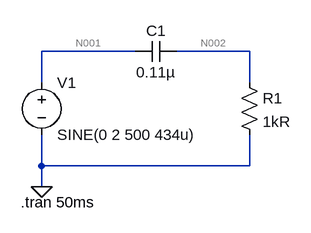
[diagram p0: schematic Draft1.asc]
Draft1.asc, the LTspice schematic file:
Version 4
SHEET 1 880 680
WIRE 176 64 32 64
WIRE 352 64 240 64
WIRE 32 112 32 64
WIRE 352 112 352 64
WIRE 32 240 32 192
WIRE 352 240 352 192
WIRE 352 240 32 240
WIRE 32 272 32 240
FLAG 32 272 0
SYMBOL voltage 32 96 R0
WINDOW 123 0 0 Left 0
WINDOW 39 0 0 Left 0
SYMATTR InstName V1
SYMATTR Value SINE(0 2 500 434u)
SYMBOL cap 240 48 R90
WINDOW 0 0 32 VBottom 2
WINDOW 3 32 32 VTop 2
SYMATTR InstName C1
SYMATTR Value 0.11µ
SYMBOL res 336 96 R0
SYMATTR InstName R1
SYMATTR Value 1kR
TEXT 0 296 Left 2 !.tran 50ms

The netlist it stands for:
* Draft1.asc
V1 N001 0 SINE(0 2 500 434u)
C1 N002 N001 0.11µ
R1 N002 0 1kR
.tran 50ms
.backanno
.end

* Results of the author's LTspice run, read from the files saved beside the schematic
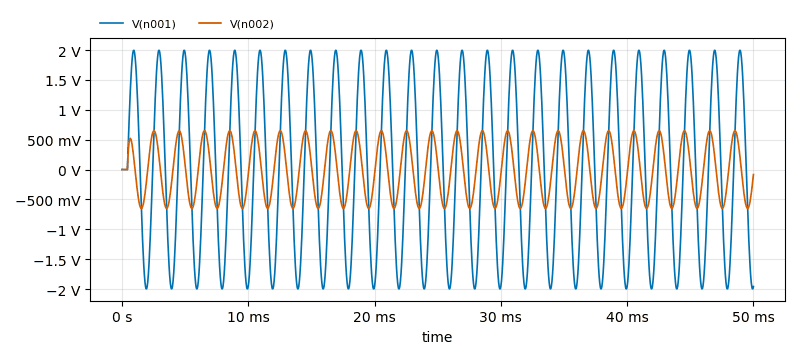
[diagram p1: Transient Analysis of Draft1.asc, plotted from the saved traces]
* Transient Analysis, 1 run:
*   V(n001): min -1.996 V, max 1.996 V, average 10.09 mV, rms 1.409 V, last -1.957 V
*   V(n002): min -650.5 mV, max 650.5 mV, average -4.14 mV, rms 457.2 mV, last -82.16 mV